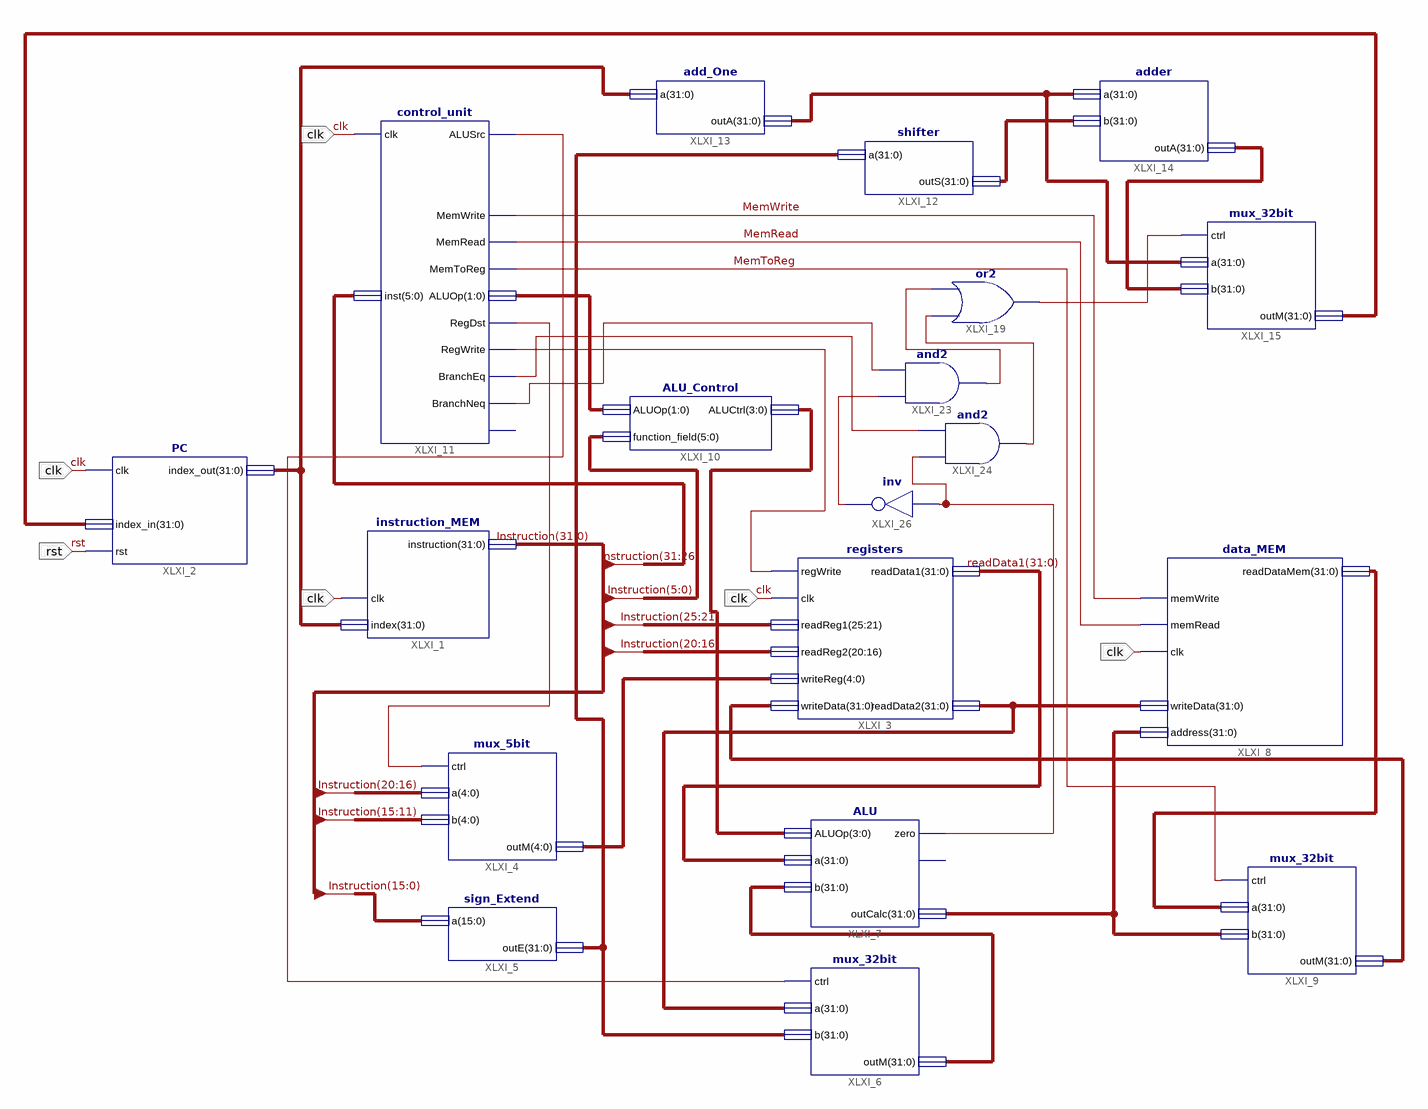
[diagram p0: schematic sheet 1]
// Xilinx ISE schematic top.sch (spartan3e) as structural Verilog: 19 symbols, 2 ports
module top (
  input  clk,
  input  rst
);

  wire MemRead, MemToReg, MemWrite, XLXN_81, XLXN_114, XLXN_117, XLXN_118, XLXN_129, XLXN_134, XLXN_151,
       XLXN_152, XLXN_154, XLXN_162;
  wire [1:0] XLXN_141;
  wire [3:0] XLXN_139;
  wire [4:0] XLXN_136;
  wire [31:0] Instruction, readData1, XLXN_22, XLXN_23, XLXN_31, XLXN_51, XLXN_88, XLXN_89, XLXN_90, XLXN_91,
       XLXN_100, XLXN_137, XLXN_150;

  instruction_MEM XLXI_1 (.clk(clk), .index(XLXN_89), .instruction(Instruction));
  PC XLXI_2 (.clk(clk), .index_in(XLXN_100), .index_out(XLXN_89), .rst(rst));
  registers XLXI_3 (
    .regWrite(XLXN_152), .clk(clk), .readReg1(Instruction[25:21]), .readReg2(Instruction[20:16]),
    .writeReg(XLXN_136), .writeData(XLXN_137), .readData1(readData1), .readData2(XLXN_31));
  mux_5bit XLXI_4 (.ctrl(XLXN_151), .a(Instruction[20:16]), .b(Instruction[15:11]), .outM(XLXN_136));
  sign_Extend XLXI_5 (.a(Instruction[15:0]), .outE(XLXN_88));
  mux_32bit XLXI_6 (.ctrl(XLXN_81), .a(XLXN_31), .b(XLXN_88), .outM(XLXN_51));
  ALU XLXI_7 (.ALUOp(XLXN_139), .a(readData1), .b(XLXN_51), .zero(XLXN_129), .outCalc(XLXN_23));  // open: overflow
  data_MEM XLXI_8 (
    .memWrite(MemWrite), .memRead(MemRead), .clk(clk), .writeData(XLXN_31), .readDataMem(XLXN_22),
    .address(XLXN_23));
  mux_32bit XLXI_9 (.ctrl(MemToReg), .a(XLXN_22), .b(XLXN_23), .outM(XLXN_137));
  ALU_Control XLXI_10 (.ALUOp(XLXN_141), .function_field(Instruction[5:0]), .ALUCtrl(XLXN_139));
  control_unit XLXI_11 (
    .clk(clk), .inst(Instruction[31:26]), .ALUSrc(XLXN_81), .MemWrite(MemWrite), .MemRead(MemRead),
    .MemToReg(MemToReg), .ALUOp(XLXN_141), .RegDst(XLXN_151), .RegWrite(XLXN_152), .BranchEq(XLXN_154),
    .BranchNeq(XLXN_162));  // open: Jump
  shifter XLXI_12 (.a(XLXN_88), .outS(XLXN_91));
  add_One XLXI_13 (.a(XLXN_89), .outA(XLXN_90));
  adder XLXI_14 (.a(XLXN_90), .b(XLXN_91), .outA(XLXN_150));
  mux_32bit XLXI_15 (.ctrl(XLXN_114), .a(XLXN_90), .b(XLXN_150), .outM(XLXN_100));
  or XLXI_19 (XLXN_114, XLXN_118, XLXN_117);
  and XLXI_23 (XLXN_117, XLXN_134, XLXN_162);
  and XLXI_24 (XLXN_118, XLXN_129, XLXN_154);
  not XLXI_26 (XLXN_134, XLXN_129);
endmodule
